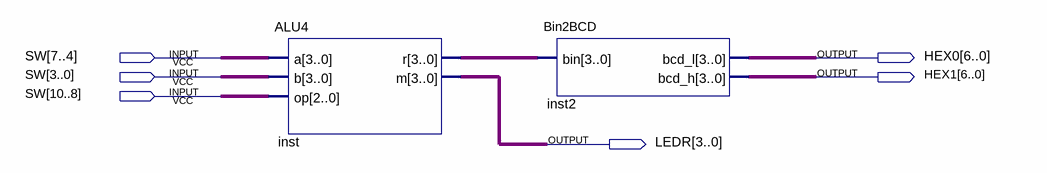
[diagram p0: schematic sheet]
// Quartus schematic ALUDemo.bdf as structural Verilog: 2 symbols, 6 pins
module ALUDemo (
  input  [10:0] SW,
  output [6:0] HEX0,
  output [6:0] HEX1,
  output [3:0] LEDR
);

  wire [3:0] inst_r;

  ALU4 inst (.a(SW[7:4]), .b(SW[3:0]), .op(SW[10:8]), .r(inst_r), .m(LEDR));
  Bin2BCD inst2 (.bin(inst_r), .bcd_l(HEX0), .bcd_h(HEX1));
endmodule
